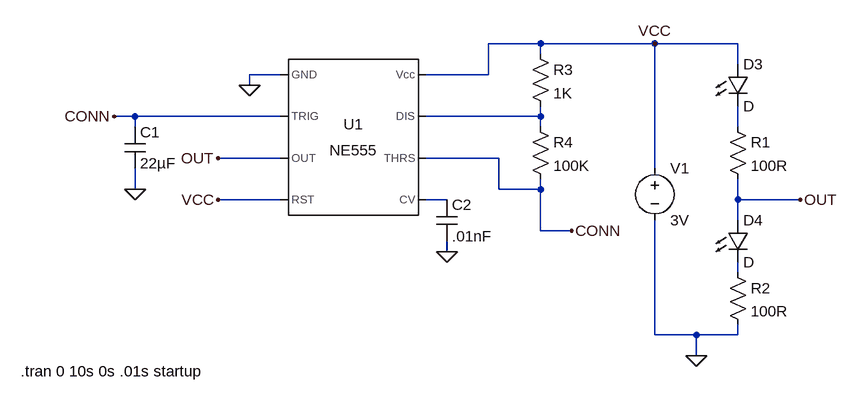
[diagram p0: schematic Blinking_LED_with_watch_battary.asc]
Blinking_LED_with_watch_battary.asc, the LTspice schematic file:
Version 4
SHEET 1 1092 680
WIRE 192 -144 112 -144
WIRE 368 -144 192 -144
WIRE 496 -144 368 -144
WIRE 192 -128 192 -144
WIRE 496 -112 496 -144
WIRE -208 -96 -256 -96
WIRE 112 -96 112 -144
WIRE 112 -96 16 -96
WIRE -256 -80 -256 -96
WIRE -432 -32 -464 -32
WIRE -208 -32 -432 -32
WIRE 192 -32 192 -48
WIRE 192 -32 16 -32
WIRE -432 -16 -432 -32
WIRE 192 -16 192 -32
WIRE 496 -16 496 -48
WIRE -208 32 -304 32
WIRE 128 32 16 32
WIRE 368 48 368 -144
WIRE -432 80 -432 48
WIRE 128 80 128 32
WIRE 192 80 192 64
WIRE 192 80 128 80
WIRE -208 96 -304 96
WIRE 48 96 16 96
WIRE 496 96 496 64
WIRE 592 96 496 96
WIRE 496 128 496 96
WIRE 192 144 192 80
WIRE 240 144 192 144
WIRE 48 176 48 160
WIRE 496 208 496 192
WIRE 368 304 368 128
WIRE 432 304 368 304
WIRE 496 304 496 288
WIRE 496 304 432 304
WIRE 432 336 432 304
FLAG 432 336 0
FLAG -464 -32 CONN
FLAG -256 -80 0
FLAG -432 80 0
FLAG 240 144 CONN
FLAG 368 -144 VCC
FLAG -304 96 VCC
FLAG 48 176 0
FLAG -304 32 OUT
FLAG 592 96 OUT
SYMBOL res 480 -32 R0
SYMATTR InstName R1
SYMATTR Value 100R
SYMBOL res 480 192 R0
SYMATTR InstName R2
SYMATTR Value 100R
SYMBOL cap -448 -16 R0
SYMATTR InstName C1
SYMATTR Value 22µF
SYMBOL cap 32 96 R0
SYMATTR InstName C2
SYMATTR Value .01nF
SYMBOL LED 480 -112 R0
SYMATTR InstName D3
SYMBOL LED 480 128 R0
SYMATTR InstName D4
SYMBOL voltage 368 32 R0
WINDOW 123 0 0 Left 0
WINDOW 39 0 0 Left 0
SYMATTR InstName V1
SYMATTR Value 3V
SYMBOL Misc\\NE555 -96 0 R0
SYMATTR InstName U1
SYMBOL res 176 -144 R0
SYMATTR InstName R3
SYMATTR Value 1K
SYMBOL res 176 -32 R0
SYMATTR InstName R4
SYMATTR Value 100K
TEXT -608 360 Left 2 !.tran 0 10s 0s .01s startup

The netlist it stands for:
* Blinking_LED_with_watch_battary.asc
R1 N002 OUT 100R
R2 N004 0 100R
C1 CONN 0 22µF
C2 N003 0 .01nF
D3 VCC N002 D
D4 OUT N004 D
V1 VCC 0 3V
XU1 0 CONN OUT VCC N003 CONN N001 VCC NE555  ; pins GND TRIG OUT RST CV THRS DIS Vcc
R3 VCC N001 1K
R4 N001 CONN 100K
.model D D
.lib standard.dio
.tran 0 10s 0s .01s startup
.lib NE555.sub
.backanno
.end